# EAGLE schematic LIC_rack_ZR-00 (EAGLE 7.2.0)
AUTHOR: M. Petrilak; VERSION: 0.1

## Sheet 1 of 4
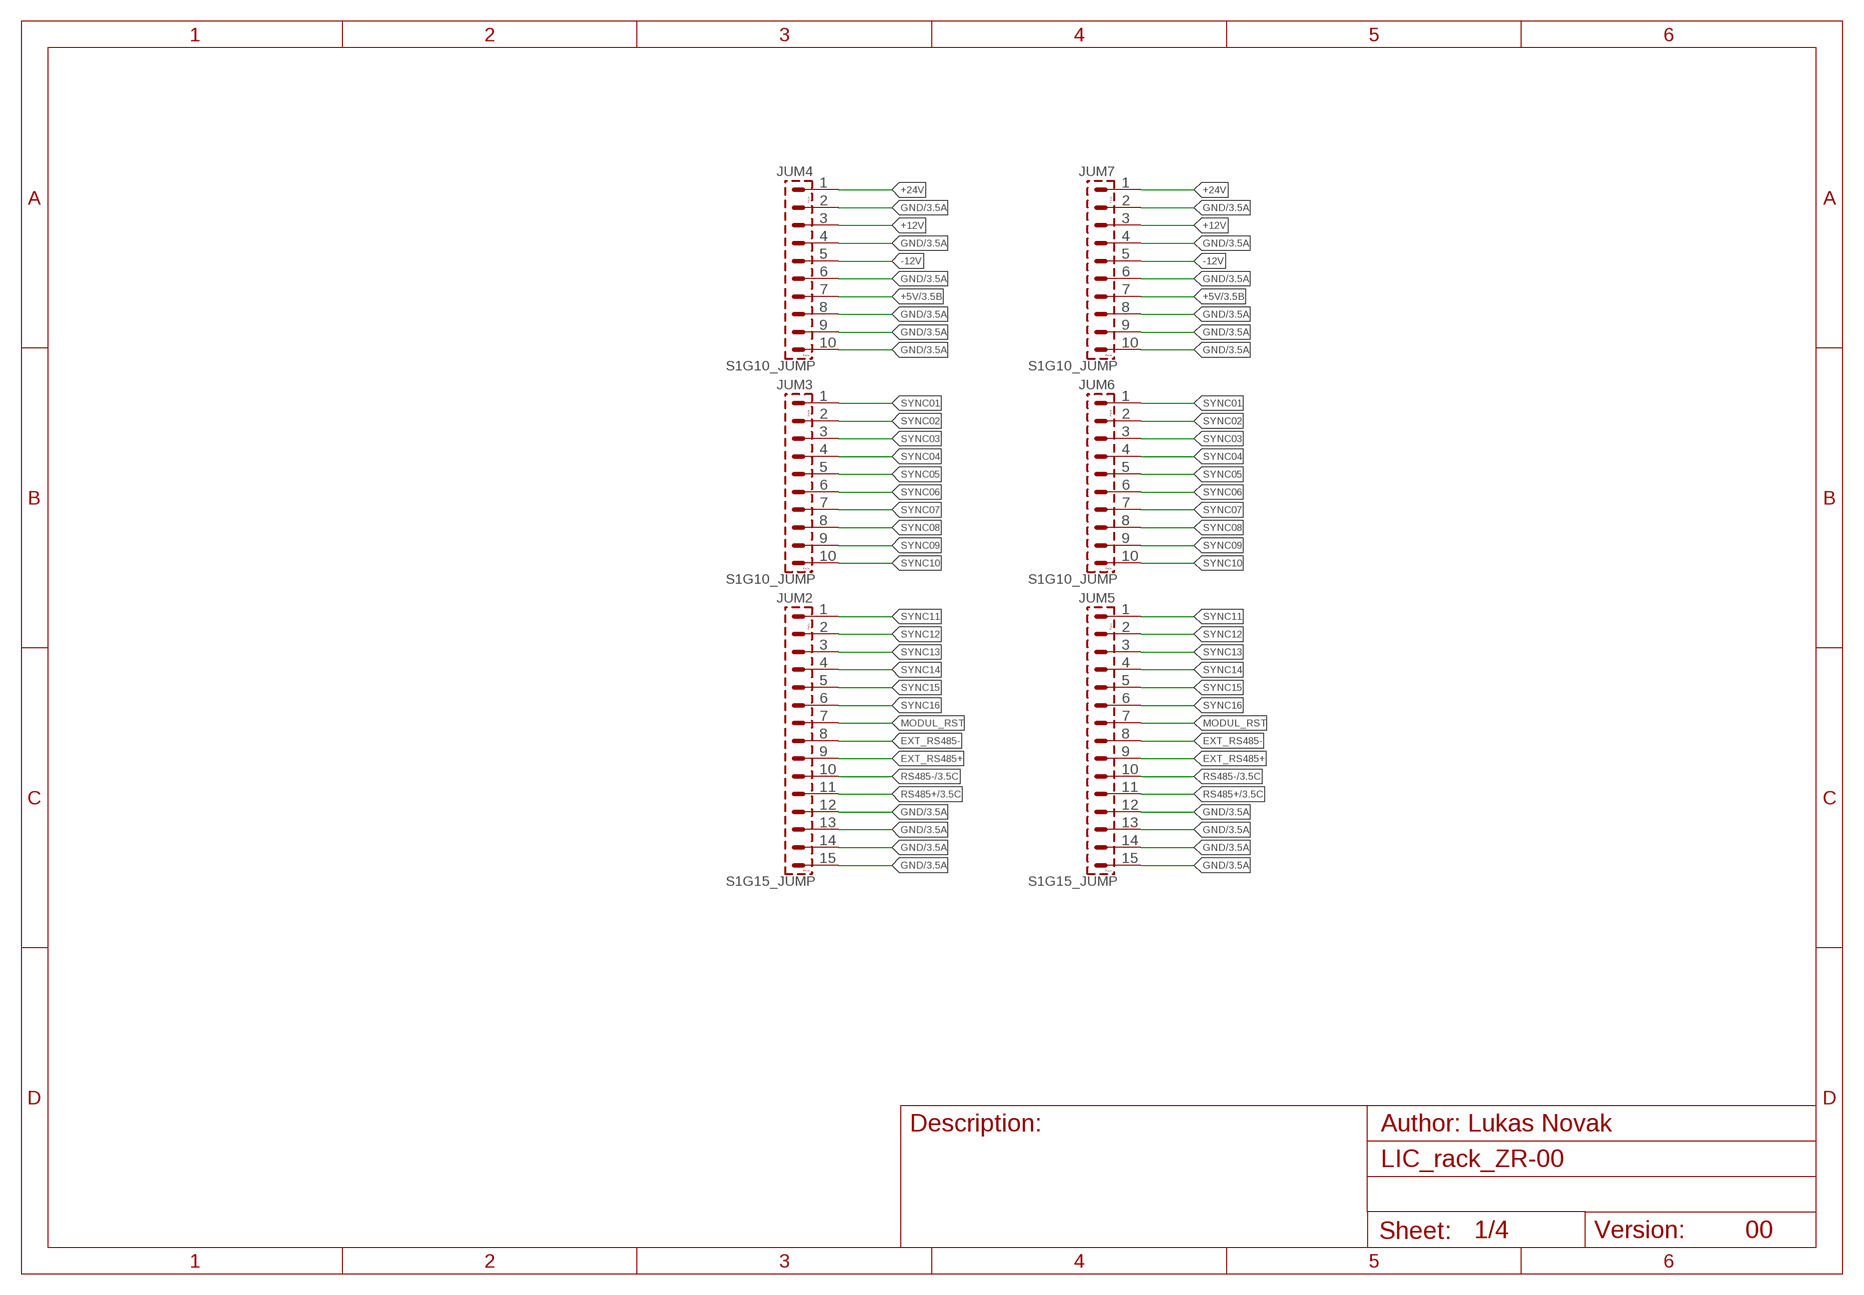
[diagram p0: schematic, sheet 1]

### Parts
JUM2  S1G15_JUMP  [S1G15_JU]
JUM3  S1G10_JUMP  [S1G10_JU]
JUM4  S1G10_JUMP  [S1G10_JU]
JUM5  S1G15_JUMP  [S1G15_JU]
JUM6  S1G10_JUMP  [S1G10_JU]
JUM7  S1G10_JUMP  [S1G10_JU]

### Nets
+5V: JUM4.7 JUM7.7 ; also sheet 2,3,4
+12V: JUM4.3 JUM7.3 ; also sheet 2,3
+24V: JUM4.1 JUM7.1 ; also sheet 2,3
-12V: JUM4.5 JUM7.5 ; also sheet 2,3
EXT_RS485+: JUM2.9 JUM5.9
EXT_RS485-: JUM2.8 JUM5.8
GND: JUM2.12 JUM2.13 JUM2.14 JUM2.15 JUM4.2 JUM4.4 JUM4.6 JUM4.8 JUM4.9 JUM4.10 JUM5.12 JUM5.13 JUM5.14 JUM5.15 JUM7.2 JUM7.4 JUM7.6 JUM7.8 JUM7.9 JUM7.10 ; also sheet 2,3,4
MODUL_RST: JUM2.7 JUM5.7
RS485+: JUM2.11 JUM5.11 ; also sheet 3
RS485-: JUM2.10 JUM5.10 ; also sheet 3
SYNC01: JUM3.1 JUM6.1
SYNC02: JUM3.2 JUM6.2
SYNC03: JUM3.3 JUM6.3
SYNC04: JUM3.4 JUM6.4
SYNC05: JUM3.5 JUM6.5
SYNC06: JUM3.6 JUM6.6
SYNC07: JUM3.7 JUM6.7
SYNC08: JUM3.8 JUM6.8
SYNC09: JUM3.9 JUM6.9
SYNC10: JUM3.10 JUM6.10
SYNC11: JUM2.1 JUM5.1
SYNC12: JUM2.2 JUM5.2
SYNC13: JUM2.3 JUM5.3
SYNC14: JUM2.4 JUM5.4
SYNC15: JUM2.5 JUM5.5
SYNC16: JUM2.6 JUM5.6

### Notes on the sheet
- 00

## Sheet 2 of 4
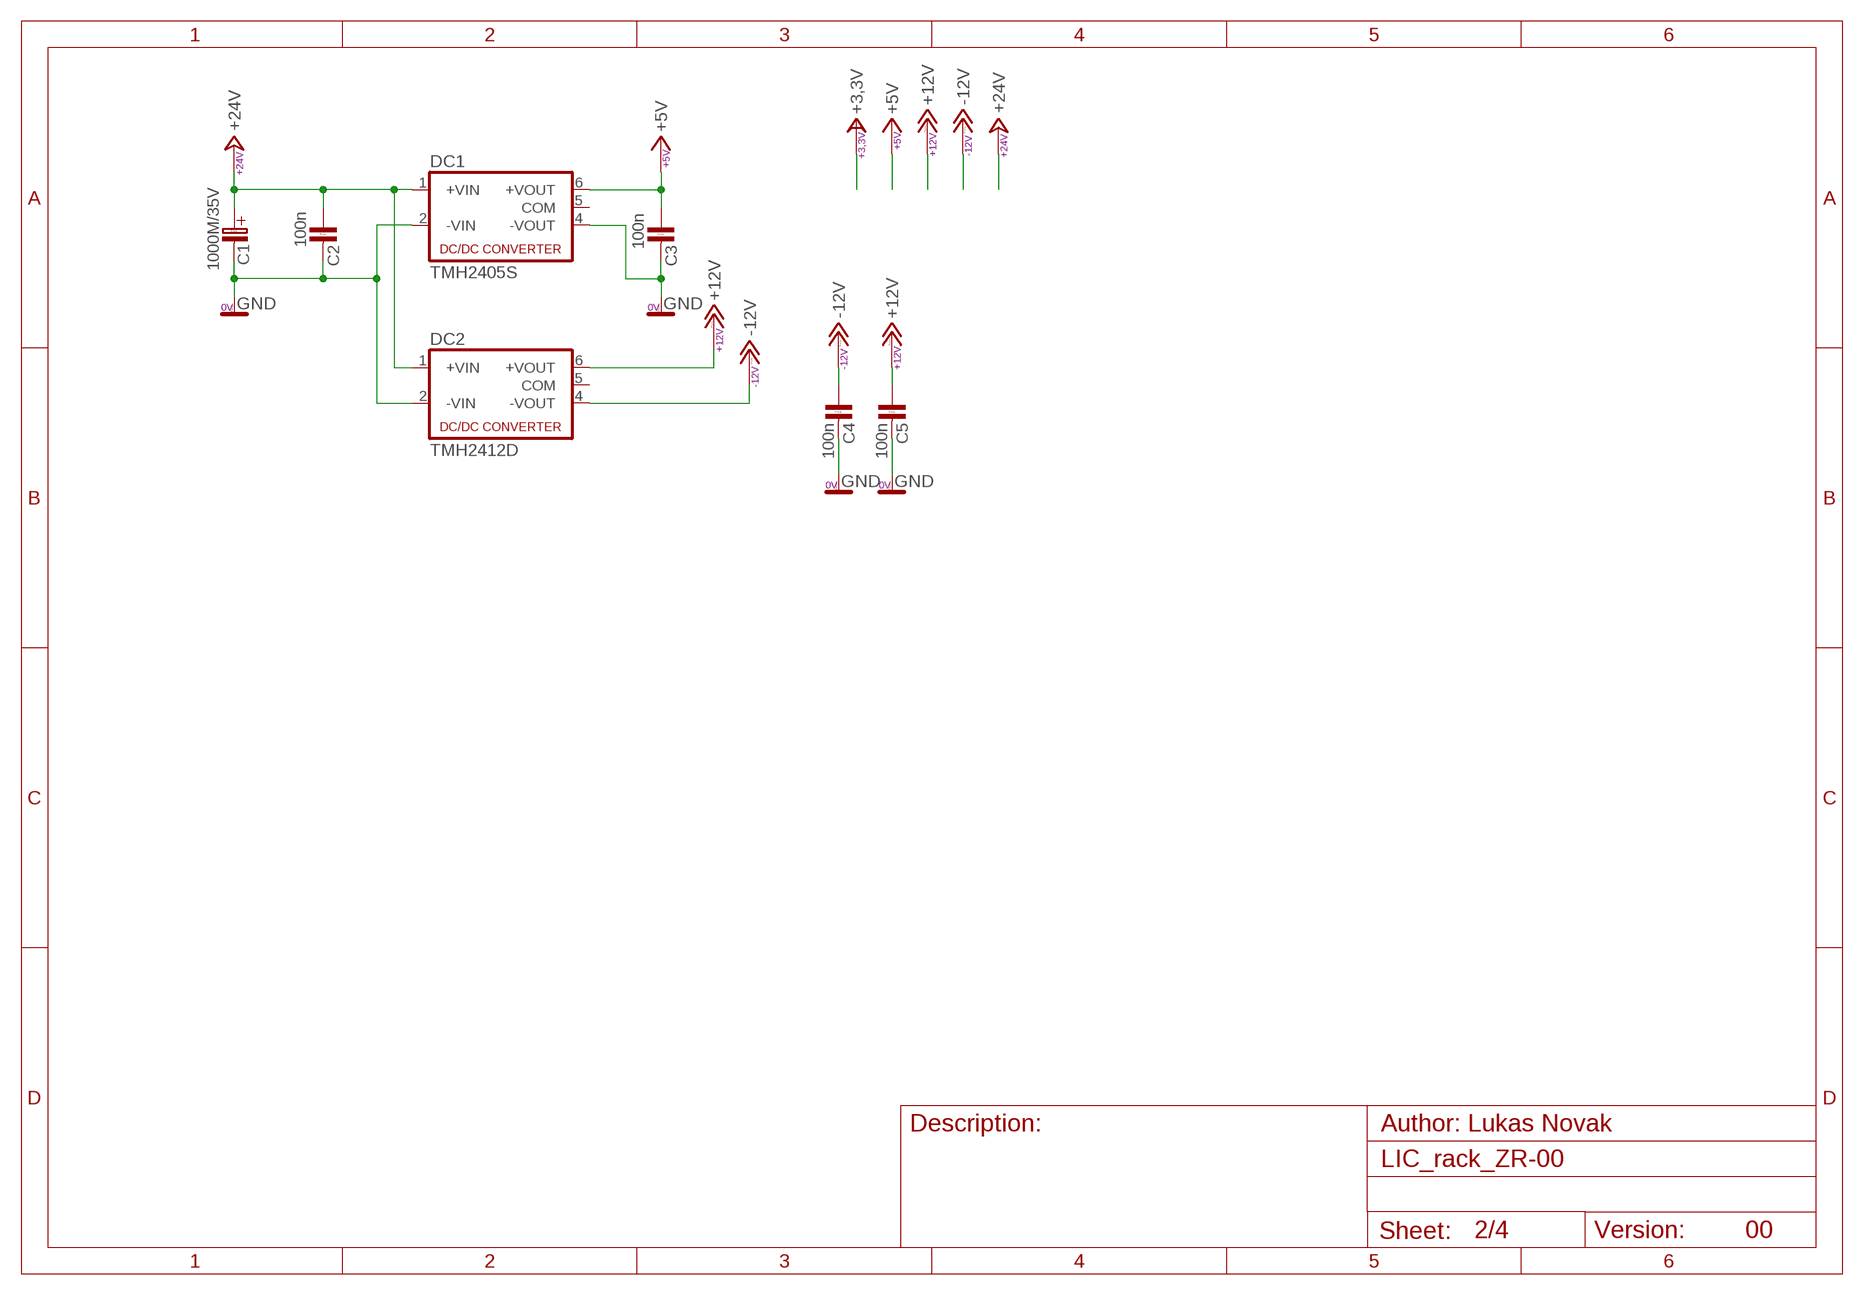
[diagram p1: schematic, sheet 2]

### Parts
C1  1000M/35V  [C_EL_5+]
C2  100n  C-KER_1206  [1206]
C3  100n  C-KER_1206  [1206]
C4  100n  C-KER_1206  [1206]
C5  100n  C-KER_1206  [1206]
DC1  TMH2405S  NMA  [NMA]
DC2  TMH2412D  NMA  [NMA]

### Nets
+5V: C3.1 DC1.6(+VOUT) ; also sheet 1,3,4
+12V: C5.1 DC2.6(+VOUT) ; also sheet 1,3
+24V: C1.C+(C_EL+) C2.1 DC1.1(+VIN) DC2.1(+VIN) ; also sheet 1,3
-12V: C4.1 DC2.4(-VOUT) ; also sheet 1,3
GND: C1.C-(C_EL-) C2.2 C3.2 C4.2 C5.2 DC1.2(-VIN) DC1.4(-VOUT) DC2.2(-VIN) ; also sheet 1,3,4
Unconnected: DC1.5(COM) DC2.5(COM)

### Notes on the sheet
- 00

## Sheet 3 of 4
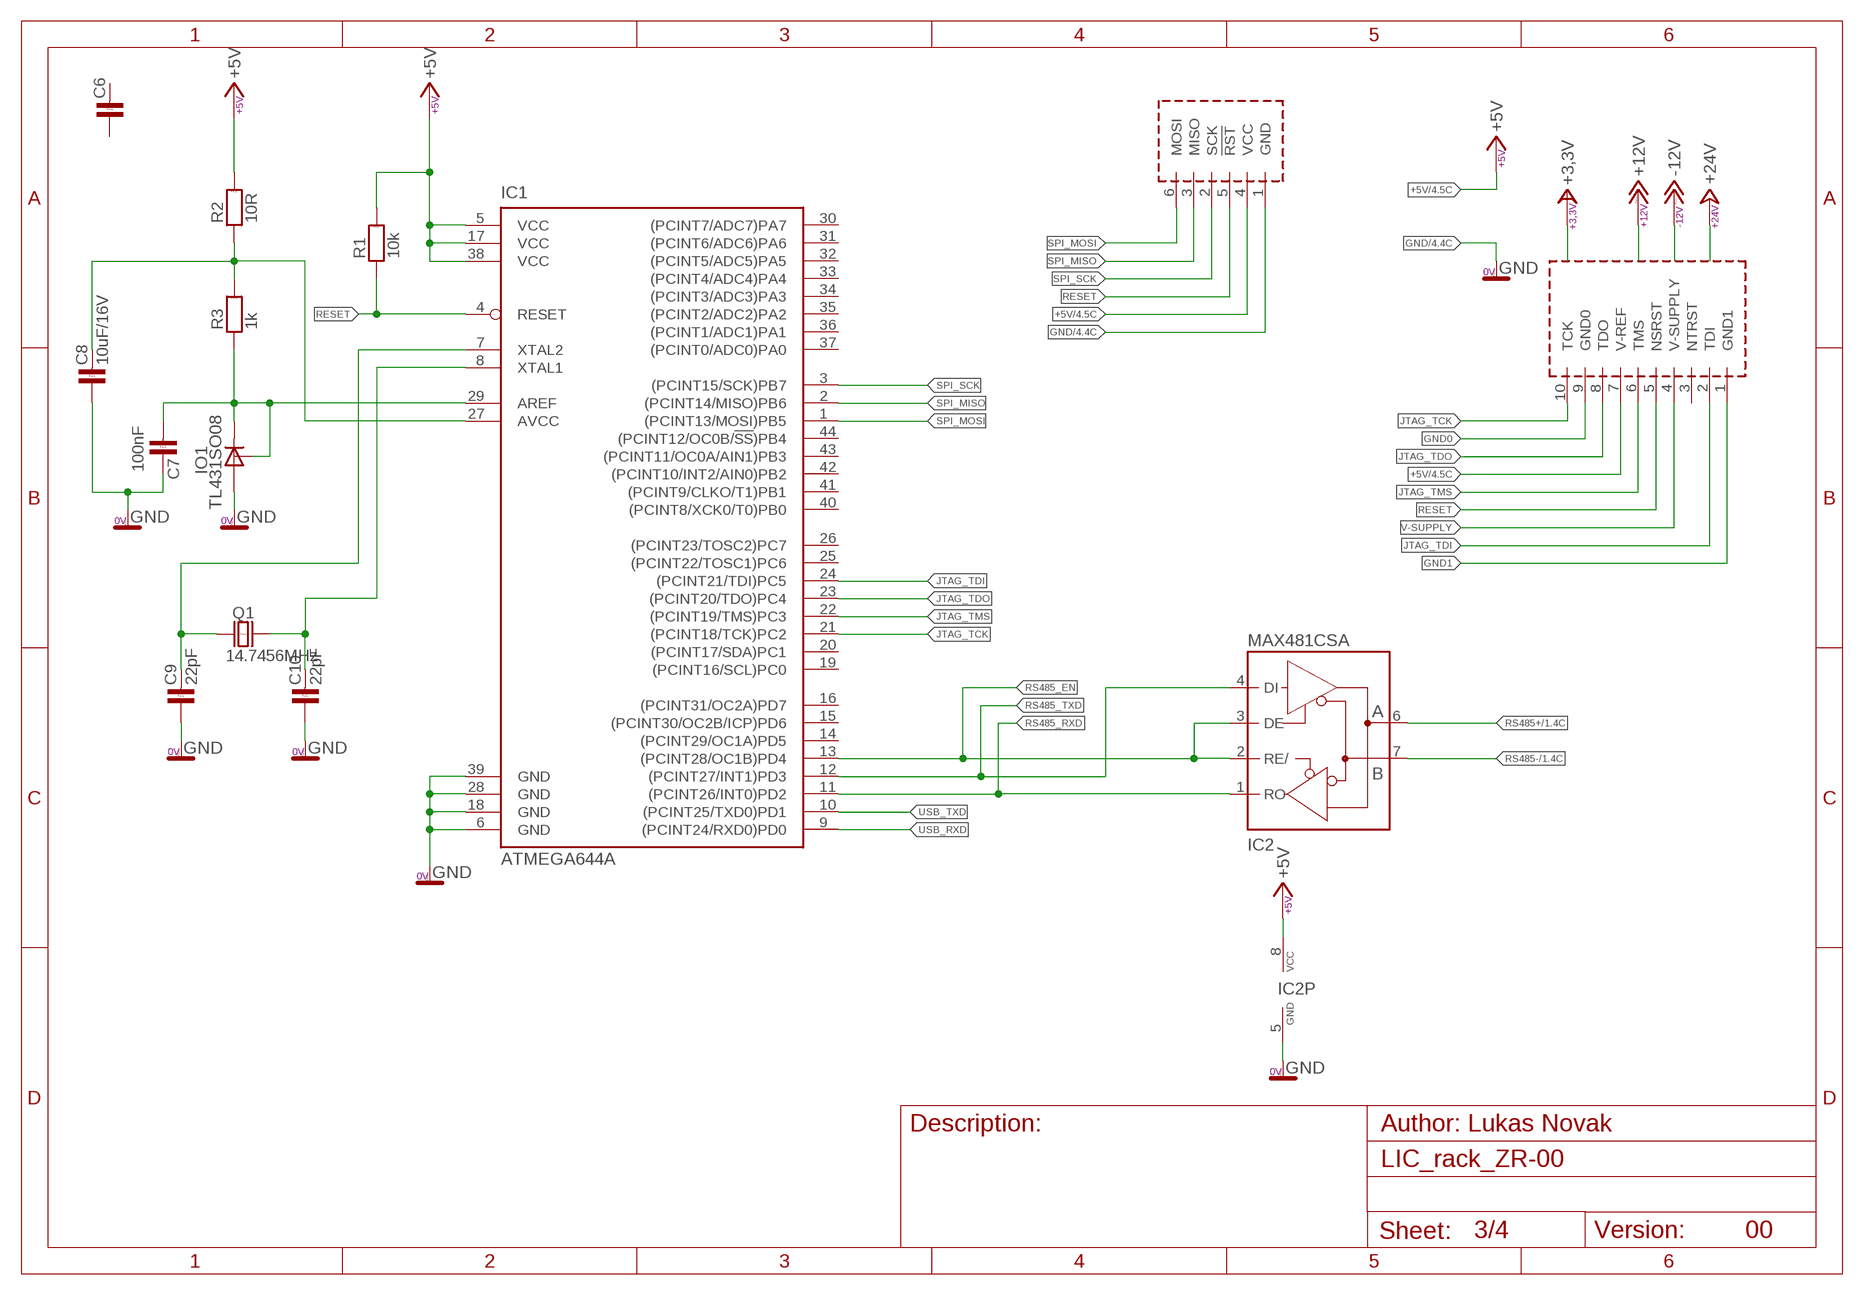
[diagram p2: schematic, sheet 3]

### Parts
C6  C-KER_1206  [1206]
C7  100nF  C-KER_1206  [1206]
C8  10uF/16V  C-KER_1206  [1206]
C9  22pF  C-KER_0805  [0805]
C10  22pF  C-KER_0805  [0805]
IC1  ATMEGA644A  [TQFP44]
IC2  MAX481CSA  [SO08]
IO1  TL431SO08  [SO08]
Q1  14.7456MHz  Q_HC-49U  [HC-49U]
R1  10k  R_1206  [1206]
R2  10R  R_1206  [1206]
R3  1k  R_1206  [1206]
U$1  AVR_PROG_JTAG  [PSH02-10P]
U$2  AVR_PROG_SPI  [PSH02-06P]

### Nets
0V: IC2.5(GND) ; supply symbol labelled GND
+5V: IC1.5(VCC) IC1.17(VCC) IC1.38(VCC) IC2.8(VCC) R1.2 R2.2 U$1.7(V-REF) U$2.4(VCC) ; also sheet 1,2,4
GND: C7.1 C8.1 C9.1 C10.1 IC1.6(GND) IC1.18(GND) IC1.28(GND) IC1.39(GND) IO1.2(A) U$2.1(GND) ; also sheet 1,2,4
GND0: U$1.9(GND0)
GND1: U$1.1(GND1)
JTAG_TCK: IC1.21((PCINT18/TCK)PC2) U$1.10(TCK)
JTAG_TDI: IC1.24((PCINT21/TDI)PC5) U$1.2(TDI)
JTAG_TDO: IC1.23((PCINT20/TDO)PC4) U$1.8(TDO)
JTAG_TMS: IC1.22((PCINT19/TMS)PC3) U$1.6(TMS)
N$1: C9.2 IC1.7(XTAL2) Q1.1
N$2: C10.2 IC1.8(XTAL1) Q1.2
N$4: C8.2 IC1.27(AVCC) R2.1 R3.2
N$7: C7.2 IC1.29(AREF) IO1.1(C) IO1.8(R) R3.1
RESET: IC1.4(RESET) R1.1 U$1.5(NSRST) U$2.5(!RST)
RS485+: IC2.6(A) ; also sheet 1
RS485-: IC2.7(B) ; also sheet 1
RS485_EN: IC1.13((PCINT28/OC1B)PD4) IC2.2(RE/) IC2.3(DE)
RS485_RXD: IC1.11((PCINT26/INT0)PD2) IC2.1(RO)
RS485_TXD: IC1.12((PCINT27/INT1)PD3) IC2.4(DI)
SPI_MISO: IC1.2((PCINT14/MISO)PB6) U$2.3(MISO)
SPI_MOSI: IC1.1((PCINT13/MOSI)PB5) U$2.6(MOSI)
SPI_SCK: IC1.3((PCINT15/SCK)PB7) U$2.2(SCK)
USB_RXD: IC1.9((PCINT24/RXD0)PD0)
USB_TXD: IC1.10((PCINT25/TXD0)PD1)
V-SUPPLY: U$1.4(V-SUPPLY)
Unconnected: C6.1 C6.2 IC1.14((PCINT29/OC1A)PD5) IC1.15((PCINT30/OC2B/ICP)PD6) IC1.16((PCINT31/OC2A)PD7) IC1.19((PCINT16/SCL)PC0) IC1.20((PCINT17/SDA)PC1) IC1.25((PCINT22/TOSC1)PC6) IC1.26((PCINT23/TOSC2)PC7) IC1.30((PCINT7/ADC7)PA7) IC1.31((PCINT6/ADC6)PA6) IC1.32((PCINT5/ADC5)PA5) IC1.33((PCINT4/ADC4)PA4) IC1.34((PCINT3/ADC3)PA3) IC1.35((PCINT2/ADC2)PA2) IC1.36((PCINT1/ADC1)PA1) IC1.37((PCINT0/ADC0)PA0) IC1.40((PCINT8/XCK0/T0)PB0) IC1.41((PCINT9/CLKO/T1)PB1) IC1.42((PCINT10/INT2/AIN0)PB2) IC1.43((PCINT11/OC0A/AIN1)PB3) IC1.44((PCINT12/OC0B/!SS!)PB4) U$1.3(NTRST)

### Notes on the sheet
- 00

## Sheet 4 of 4
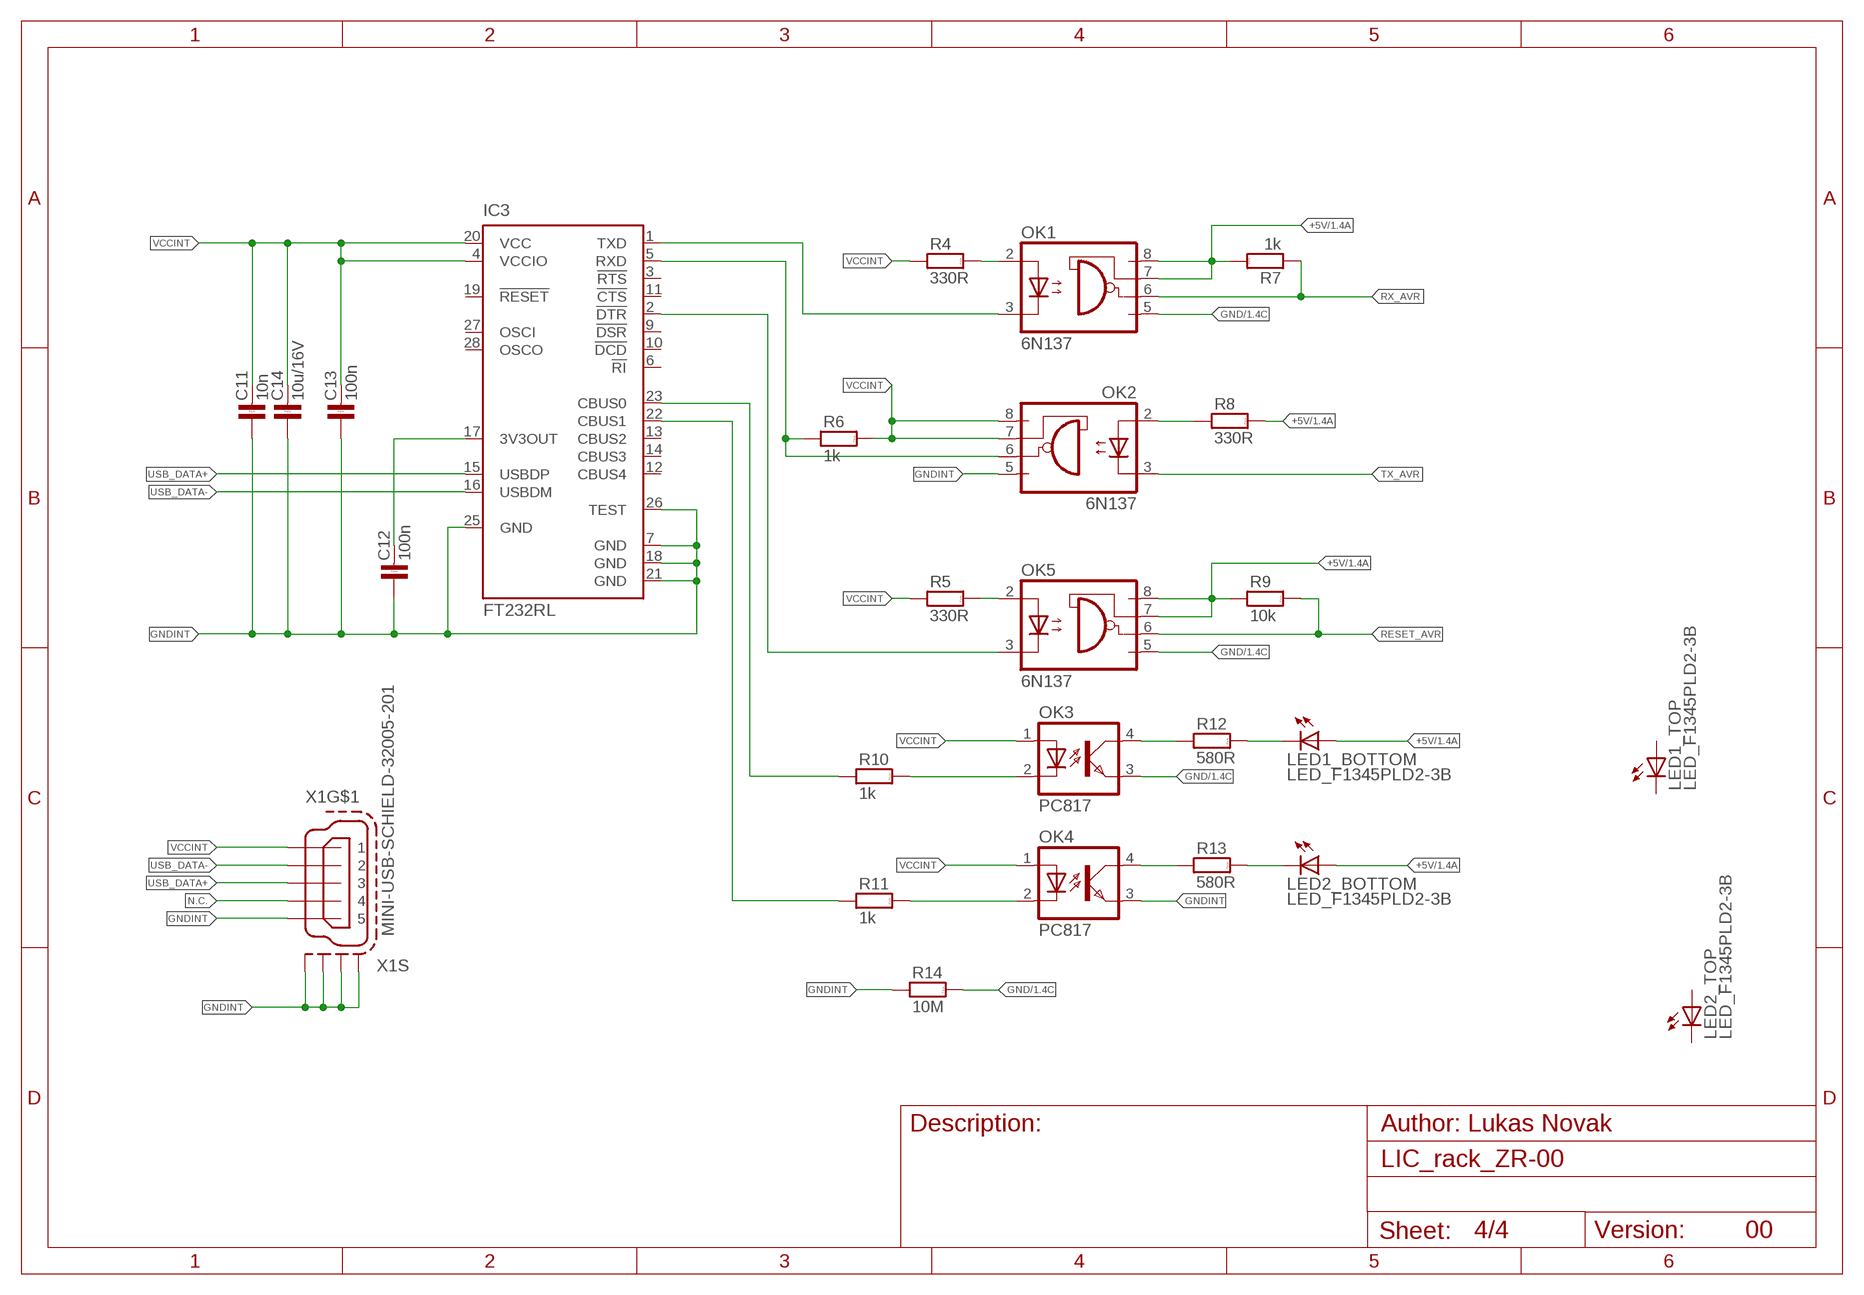
[diagram p3: schematic, sheet 4]

### Parts
C11  10n  C-KER_1206  [1206]
C12  100n  C-KER_1206  [1206]
C13  100n  C-KER_1206  [1206]
C14  10u/16V  C-KER_1206  [1206]
IC3  FT232RL  [SSOP28]
LED1  LED_F1345PLD2-3B  [LED_F1345PLD2-3B]
LED2  LED_F1345PLD2-3B  [LED_F1345PLD2-3B]
OK1  6N137  [DIL08]
OK2  6N137  [DIL08]
OK3  PC817  [DIL04]
OK4  PC817  [DIL04]
OK5  6N137  [DIL08]
R4  330R  R_1206  [1206]
R5  330R  R_1206  [1206]
R6  1k  R_1206  [1206]
R7  1k  R_1206  [1206]
R8  330R  R_1206  [1206]
R9  10k  R_1206  [1206]
R10  1k  R_1206  [1206]
R11  1k  R_1206  [1206]
R12  580R  R_1206  [1206]
R13  580R  R_1206  [1206]
R14  10M  R_1206  [1206]
X1  MINI-USB-SCHIELD-32005-201  [32005-201]

### Nets
+5V: LED1.1A(A) LED2.1A(A) OK1.7(VE) OK1.8(VCC) OK5.7(VE) OK5.8(VCC) R7.2 R8.2 R9.1 ; also sheet 1,2,3
GND: OK1.5(GND) OK3.3(EMIT) OK5.5(GND) R14.2 ; also sheet 1,2,3
GNDINT: C11.1 C12.1 C13.1 C14.1 IC3.7(GND) IC3.18(GND) IC3.21(GND) IC3.25(GND) IC3.26(TEST) OK2.5(GND) OK4.3(EMIT) R14.1 X1.5 X1.M1(S:S1) X1.M2(S:S2) X1.M3(S:S3) X1.M4(S:S4)
N$3: IC3.2(!DTR) OK5.3(C)
N$5: OK1.2(A) R4.2
N$6: IC3.1(TXD) OK1.3(C)
N$8: IC3.5(RXD) OK2.6(VO) R6.1
N$9: OK2.2(A) R8.1
N$10: IC3.23(CBUS0) R10.1
N$11: IC3.22(CBUS1) R11.1
N$12: OK5.2(A) R5.2
N$13: OK3.2(C) R10.2
N$14: OK4.2(C) R11.2
N$15: OK3.4(COL) R12.1
N$16: LED1.1K(C) R12.2
N$17: LED2.1K(C) R13.2
N$18: OK4.4(COL) R13.1
N$22: C12.2 IC3.17(3V3OUT)
N.C.: X1.4
RESET_AVR: OK5.6(VO) R9.2
RX_AVR: OK1.6(VO) R7.1
TX_AVR: OK2.3(C)
USB_DATA+: IC3.15(USBDP) X1.3
USB_DATA-: IC3.16(USBDM) X1.2
VCCINT: C11.2 C13.2 C14.2 IC3.4(VCCIO) IC3.20(VCC) OK2.7(VE) OK2.8(VCC) OK3.1(A) OK4.1(A) R4.1 R5.1 R6.2 X1.1
Unconnected: IC3.3(!RTS) IC3.6(!RI) IC3.9(!DSR) IC3.10(!DCD) IC3.11(!CTS) IC3.12(CBUS4) IC3.13(CBUS2) IC3.14(CBUS3) IC3.19(!RESET) IC3.27(OSCI) IC3.28(OSCO) LED1.2A(A) LED1.2K(C) LED2.2A(A) LED2.2K(C)

### Notes on the sheet
- 00

## Library data of the parts
C1 = #PaJa_C-el_2:1000M/35V
C2-C14 = #PaJa_31:C-KER: Kondenzator - keramicky
DC1 DC2 = dc-dc-converter:NMA: DC-DC CONVERTER; MF: C & D TECHNOLOGIES, INC; MPN: NMA0515SC; OC_FARNELL: 1021434; OC_NEWARK: 61K3064
IC1 = atmel:ATMEGA644: 8-bit Microcontroller with 64K Bytes In-System Programmable Flash Source: http://www.atmel.com/dyn/resources/prod_documents/doc2593.pdf; MPN: ATMEGA644PV-10AU; OC_FARNELL: 1455123; OC_NEWARK: 58M3748
IC2 = maxim:MAX481CSA: RS485 TRANSEIVER; MF: MAXIM; MPN: MAX481CSA; OC_FARNELL: unknown; OC_NEWARK: 90C3817
IC3 = ftdichip:FT232R: Source: http://www.ftdichip.com/Documents/DataSheets/DS_FT232R_v104.pdf; MPN: FT232RL; OC_FARNELL: 1146032; OC_NEWARK: 91K9918
IO1 = references:TL431: Programmable Shunt Regulator TL431 Features > Programmable Output Voltage to 36 Volts > Low Dynamic Output Impedance 0.2? Typical > Sink Current Capability of 1.0 to 100mA > Equivalent Full-Range Temperature Coefficient of 50ppm/°C Typical > Temperature Compensated For Operation Over Full Rated Operating Temperature Range > Low Output Noise Voltage > Fast Turn-on Response; MPN: TL431CDT; OC_FARNELL: 1750206; PACKAGE: SO-08; SUPPLIER: STM
JUM2 JUM5 = #PaJa_konektory:S1G15_JUMP: Radove konektory - koliky - 15x
JUM3 JUM4 JUM6 JUM7 = #PaJa_konektory:S1G10_JUMP: Radove konektory - koliky - 10x
LED1 LED2 = LED_Knihovna:LED_F1345PLD2-3B
OK1 OK2 OK5 = optocoupler:6N137: MOTOROLA OPTO COUPLER; MPN: 6N137; OC_FARNELL: 1328376; OC_NEWARK: 52M1895
OK3 OK4 = optocoupler:PC817: SHARP OPTO COUPLER; MPN: PC817X4J000F; OC_FARNELL: 9707727; OC_NEWARK: 97K7059
Q1 = #PaJa_31:Q: Krystal HC-49 - 1MHz - 48MHz DT38 - Quartz (hodinovy) 32,768kHz
R1-R14 = #PaJa_31:R: Rezistor
U$1 = #PaJa_konektory:AVR_PROG_JTAG
U$2 = #PaJa_konektory:AVR_PROG_SPI
X1 = con-cypressindustries:MINI-USB-SCHIELD-: MINI USB-B Conector Source: www.cypressindustries.com; OC_FARNELL: unknown; OC_NEWARK: unknown

## Net classes
0 default: clearance 0.2 mm
1 LNPE: clearance 2.5 mm to class 0, clearance 1 mm